# EAGLE design ME433_board (EAGLE 8.7.1)
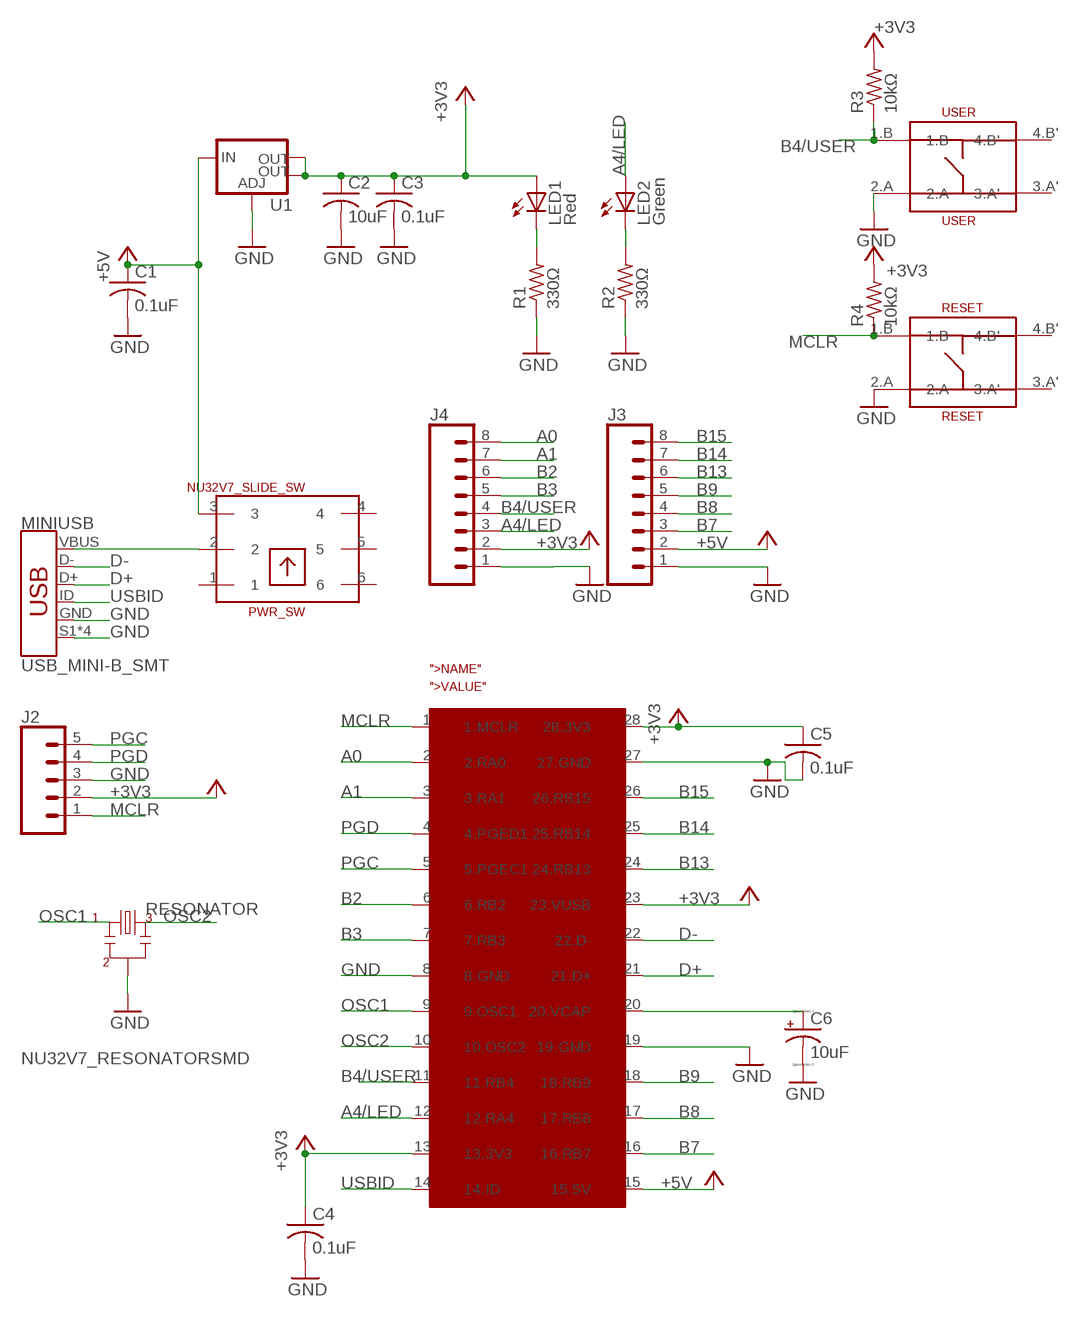
[diagram p0: schematic, sheet 1]

## Parts
C1  0.1uF  C-USC0603  [C0603]
C2  10uF  C-USC0603  [C0603]
C3  0.1uF  C-USC0603  [C0603]
C4  0.1uF  C-USC0603  [C0603]
C5  0.1uF  C-USC0603  [C0603]
C6  10uF  CPOL-US153CLV-0605  [153CLV-0605]
J2  CONN_05  [1X05]
J3  CONN_08"  [1X08]
J4  CONN_08"  [1X08]
LED1  Red  LEDSML0603  [SML0603]
LED2  Green  LEDSML0603  [SML0603]
MINIUSB  USB_MINI-B_SMT  [USB-MINIB]
PWR_SW  NU32V7_SLIDE_SW  [NU32V7_SLIDE_SW]
R1  330Ω  R-US_R0603  [R0603]
R2  330Ω  R-US_R0603  [R0603]
R3  10kΩ  R-US_R0603  [R0603]
R4  10kΩ  R-US_R0603  [R0603]
RESET  RESET  NU32V7_MOM_SW  [NU32V7_MOM_SW]
RESONATOR  NU32V7_RESONATORSMD  [NU32V7_RESONATOR-SMD]
U1  NU32V7_V_REG_LM1117SOT223  [NU32V7_SOT223]
U$1  PIC32  [DIL28-3]
USER  USER  NU32V7_MOM_SW  [NU32V7_MOM_SW]

## Nets
+3V3: C2.1 C3.1 C4.1 C5.1 J2.2 J4.2 LED1.A R3.2 R4.2 U1.2(OUT) U1.4(OUT) U$1.13(13.3V3) U$1.23(23.VUSB) U$1.28(28.3V3)
+5V: C1.1 J3.2 PWR_SW.3 U1.3(IN) U$1.15(15.5V)
A0: J4.8 U$1.2(2.RA0)
A1: J4.7 U$1.3(3.RA1)
A4/LED: J4.3 LED2.A U$1.12(12.RA4)
B2: J4.6 U$1.6(6.RB2)
B3: J4.5 U$1.7(7.RB3)
B4/USER: J4.4 R3.1 U$1.11(11.RB4) USER.1.B
B7: J3.3 U$1.16(16.RB7)
B8: J3.4 U$1.17(17.RB8)
B9: J3.5 U$1.18(18.RB9)
B13: J3.6 U$1.24(24.RB13)
B14: J3.7 U$1.25(25.RB14)
B15: J3.8 U$1.26(26.RB15)
D+: MINIUSB.D+ U$1.21(21.D+)
D-: MINIUSB.D- U$1.22(22.D-)
GND: C1.2 C2.2 C3.2 C4.2 C5.2 C6.- J2.3 J3.1 J4.1 MINIUSB.GND MINIUSB.S1(SHIELD) MINIUSB.S2(SHIELD) MINIUSB.S3(SHIELD) MINIUSB.S4(SHIELD) R1.1 R2.1 RESET.2.A RESONATOR.2 U1.1(ADJ) U$1.8(8.GND) U$1.19(19.GND) U$1.27(27.GND) USER.2.A
MCLR: J2.1 R4.1 RESET.1.B U$1.1(1.MCLR)
N$1: MINIUSB.VBUS PWR_SW.2
N$2: LED2.C R2.2
N$3: LED1.C R1.2
N$21: C6.+ U$1.20(20.VCAP)
OSC1: RESONATOR.1 U$1.9(9.OSC1)
OSC2: RESONATOR.3 U$1.10(10.OSC2)
PGC: J2.5 U$1.5(5.PGEC1)
PGD: J2.4 U$1.4(4.PGED1)
USBID: MINIUSB.ID U$1.14(14.ID)
Unconnected: PWR_SW.1 PWR_SW.4 PWR_SW.5 PWR_SW.6 RESET.3.A' RESET.4.B' USER.3.A' USER.4.B'

## Library data of the parts
C1-C5 = ME433_library:C-US: CAPACITOR, American symbol
C6 = ME433_library:CPOL-US: POLARIZED CAPACITOR, American symbol
J2 = SparkFun-Connectors:CONN_05: Multi connection point. Often used as Generic Header-pin footprint for 0.1 inch spaced/style header connections On any of the 0.1 inch spaced packages, you can populate with these: Break Away Headers - Straight <https://www.sparkfun.com/products/116> (PRT-00116) Break Away Male Headers - Right Angle <https://www.sparkfun.com/products/553> (PRT-00553) Female Headers <https://www.sparkfun.com/products/115> (PRT-00115) Break Away Headers - Machine Pin <https://www.sparkfun.com/products/117> (PRT-00117) Break Away Female Headers - Swiss Machine Pin <https://www.sparkfun.com/products/743> (PRT-00743) For SCREWTERMINALS and SPRING TERMINALS visit here: Screw Terimnals on SparkFun.com <https://www.sparkfun.com/search/results?term=Screw+Terminals> (5mm/3.5mm/2.54mm spacing) This device is also useful as a general connection point to wire up your design to another part of your project. Our various solder wires solder well into these plated through hole pads. Hook-Up Wire - Assortment (Stranded, 22 AWG) <https://www.sparkfun.com/products/11375> (PRT-11375) Hook-Up Wire - Assortment (Solid Core, 22 AWG) <https://www.sparkfun.com/products/11367> (PRT-11367) View the entire wire category on our website here <https://www.sparkfun.com/categories/141> Special notes: Molex polarized connector foot print use with SKU : PRT-08231 with associated crimp pins and housings. 1MM SMD Version SKU: PRT-10208
J3 J4 = SparkFun-Connectors:CONN_08: Multi connection point. Often used as Generic Header-pin footprint for 0.1 inch spaced/style header connections On any of the 0.1 inch spaced packages, you can populate with these: Break Away Headers - Straight <https://www.sparkfun.com/products/116> (PRT-00116) Break Away Male Headers - Right Angle <https://www.sparkfun.com/products/553> (PRT-00553) Female Headers <https://www.sparkfun.com/products/115> (PRT-00115) Break Away Headers - Machine Pin <https://www.sparkfun.com/products/117> (PRT-00117) Break Away Female Headers - Swiss Machine Pin <https://www.sparkfun.com/products/743> (PRT-00743) Arduino Stackable Header - 8 Pin <https://www.sparkfun.com/products/9279> (PRT-09279) For SCREWTERMINALS and SPRING TERMINALS visit here: Screw Terimnals on SparkFun.com <https://www.sparkfun.com/search/results?term=Screw+Terminals> (5mm/3.5mm/2.54mm spacing) This device is also useful as a general connection point to wire up your design to another part of your project. Our various solder wires solder well into these plated through hole pads. Hook-Up Wire - Assortment (Stranded, 22 AWG) <https://www.sparkfun.com/products/11375> (PRT-11375) Hook-Up Wire - Assortment (Solid Core, 22 AWG) <https://www.sparkfun.com/products/11367> (PRT-11367) View the entire wire category on our website here <https://www.sparkfun.com/categories/141> Special notes: Molex polarized connector foot print use with SKU : PRT-08231 with associated crimp pins and housings. 1MM SMD Version SKU: PRT-10208 NOTES ON THE VARIANTS LOCK and LOCK_LONGPADS... This footprint was designed to help hold the alignment of a through-hole component (i.e. 6-pin header) while soldering it into place. You may notice that each hole has been shifted either up or down by 0.005 of an inch from it's more standard position (which is a perfectly straight line). This slight alteration caused the pins (the squares in the middle) to touch the edges of the holes. Because they are alternating, it causes a "brace" to hold the component in place. 0.005 has proven to be the perfect amount of "off-center" position when using our standard breakaway headers. Although looks a little odd when you look at the bare footprint, once you have a header in there, the alteration is very hard to notice. Also,if you push a header all the way into place, it is covered up entirely on the bottom side.; PROD_ID: CONN-08438
LED1 LED2 = ME433_library:LED: LED OSRAM: - CHIPLED LG R971, LG N971, LY N971, LG Q971, LY Q971, LO R971, LY R971 LH N974, LH R974 LS Q976, LO Q976, LY Q976 LO Q996 - Hyper CHIPLED LW Q18S LB Q993, LB Q99A, LB R99A - SideLED LS A670, LO A670, LY A670, LG A670, LP A670 LB A673, LV A673, LT A673, LW A673 LH A674 LY A675 LS A676, LA A676, LO A676, LY A676, LW A676 LS A679, LY A679, LG A679 - Hyper Micro SIDELED® LS Y876, LA Y876, LO Y876, LY Y876 LT Y87S - SmartLED LW L88C, LW L88S LB L89C, LB L89S, LG L890 LS L89K, LO L89K, LY L89K LS L896, LA L896, LO L896, LY L896 - TOPLED LS T670, LO T670, LY T670, LG T670, LP T670 LSG T670, LSP T670, LSY T670, LOP T670, LYG T670 LG T671, LOG T671, LSG T671 LB T673, LV T673, LT T673, LW T673 LH T674 LS T676, LA T676, LO T676, LY T676, LB T676, LH T676, LSB T676, LW T676 LB T67C, LV T67C, LT T67C, LS T67K, LO T67K, LY T67K, LW E67C LS E67B, LA E67B, LO E67B, LY E67B, LB E67C, LV E67C, LT E67C LW T67C LS T679, LY T679, LG T679 LS T770, LO T770, LY T770, LG T770, LP T770 LB T773, LV T773, LT T773, LW T773 LH T774 LS E675, LA E675, LY E675, LS T675 LS T776, LA T776, LO T776, LY T776, LB T776 LHGB T686 LT T68C, LB T68C - Hyper Mini TOPLED® LB M676 - Mini TOPLED Santana® LG M470 LS M47K, LO M47K, LY M47K Source: http://www.osram.convergy.de LUXEON: - LUMILED® LXK2-PW12-R00, LXK2-PW12-S00, LXK2-PW14-U00, LXK2-PW14-V00 LXK2-PM12-R00, LXK2-PM12-S00, LXK2-PM14-U00 LXK2-PE12-Q00, LXK2-PE12-R00, LXK2-PE12-S00, LXK2-PE14-T00, LXK2-PE14-U00 LXK2-PB12-K00, LXK2-PB12-L00, LXK2-PB12-M00, LXK2-PB14-N00, LXK2-PB14-P00, LXK2-PB14-Q00 LXK2-PR12-L00, LXK2-PR12-M00, LXK2-PR14-Q00, LXK2-PR14-R00 LXK2-PD12-Q00, LXK2-PD12-R00, LXK2-PD12-S00 LXK2-PH12-R00, LXK2-PH12-S00 LXK2-PL12-P00, LXK2-PL12-Q00, LXK2-PL12-R00 Source: www.luxeon.com KINGBRIGHT: KA-3528ASYC Source: www.kingbright.com
MINIUSB = ME433_library:USB_MINI-B: USB type Mini-B Connector Breaks out 5th pin, and includes shield pins if needed. SparkFun Products: SparkFun FTDI Basic Breakout <https://www.sparkfun.com/products/9716> SparkFun XBee Explorer USB <https://www.sparkfun.com/products/11812> SparkFun Redboard <https://www.sparkfun.com/products/12757>; PROD_ID: CONN-08193; SF_ID: PRT-00587
PWR_SW = ME433_library:NU32V7_SLIDE_SW
R1-R4 = ME433_library:R-US_: RESISTOR, American symbol
RESET USER = ME433_library:NU32V7_MOM_SW
RESONATOR = ME433_library:NU32V7_RESONATOR: Resonator Small SMD resonator. This is the itty bitty 10/20MHz resonators with built in caps. CSTCE10M0G55 and CSTCE20M0V53. Footprint has been reviewed closely but hasn't been tested yet.
U1 = ME433_library:NU32V7_V_REG_LM1117: Voltage Regulator LM1117 Standard adjustable voltage regulator but in SMD form. Spark Fun Electronics SKU : COM-00595; PROD_ID: VREG-08170
U$1 = ME433_library:PIC32

## Board
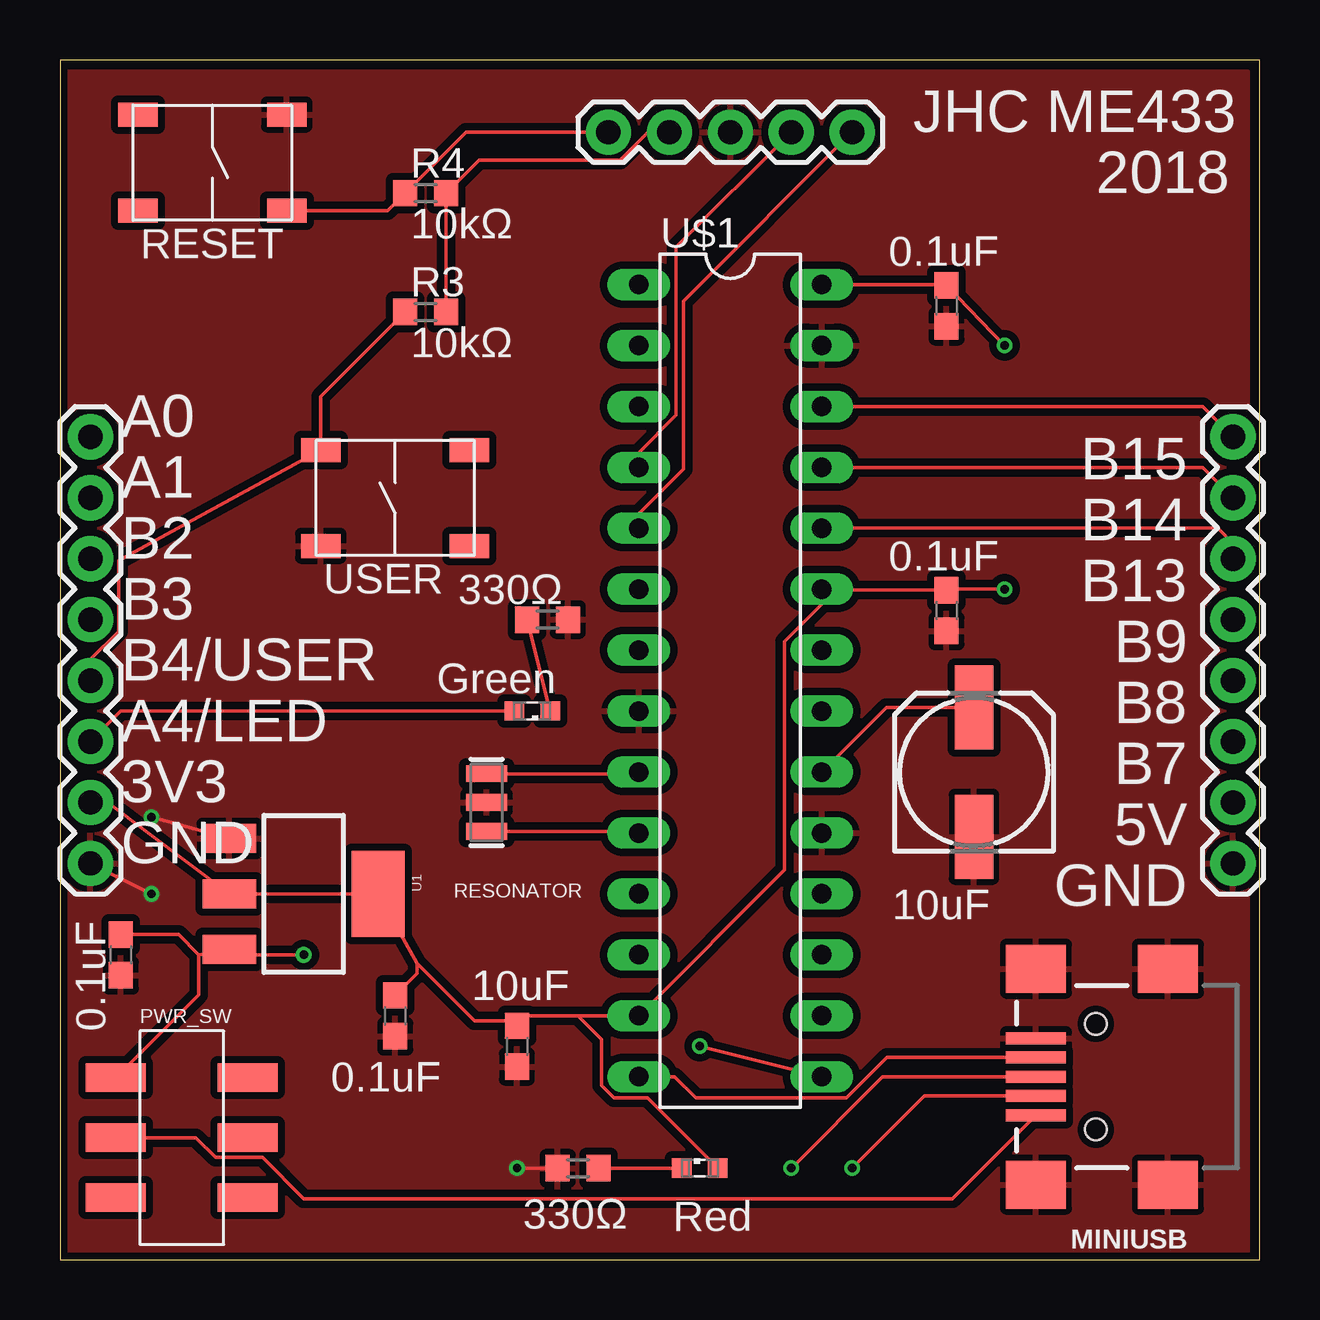
[diagram p1: board, top side]
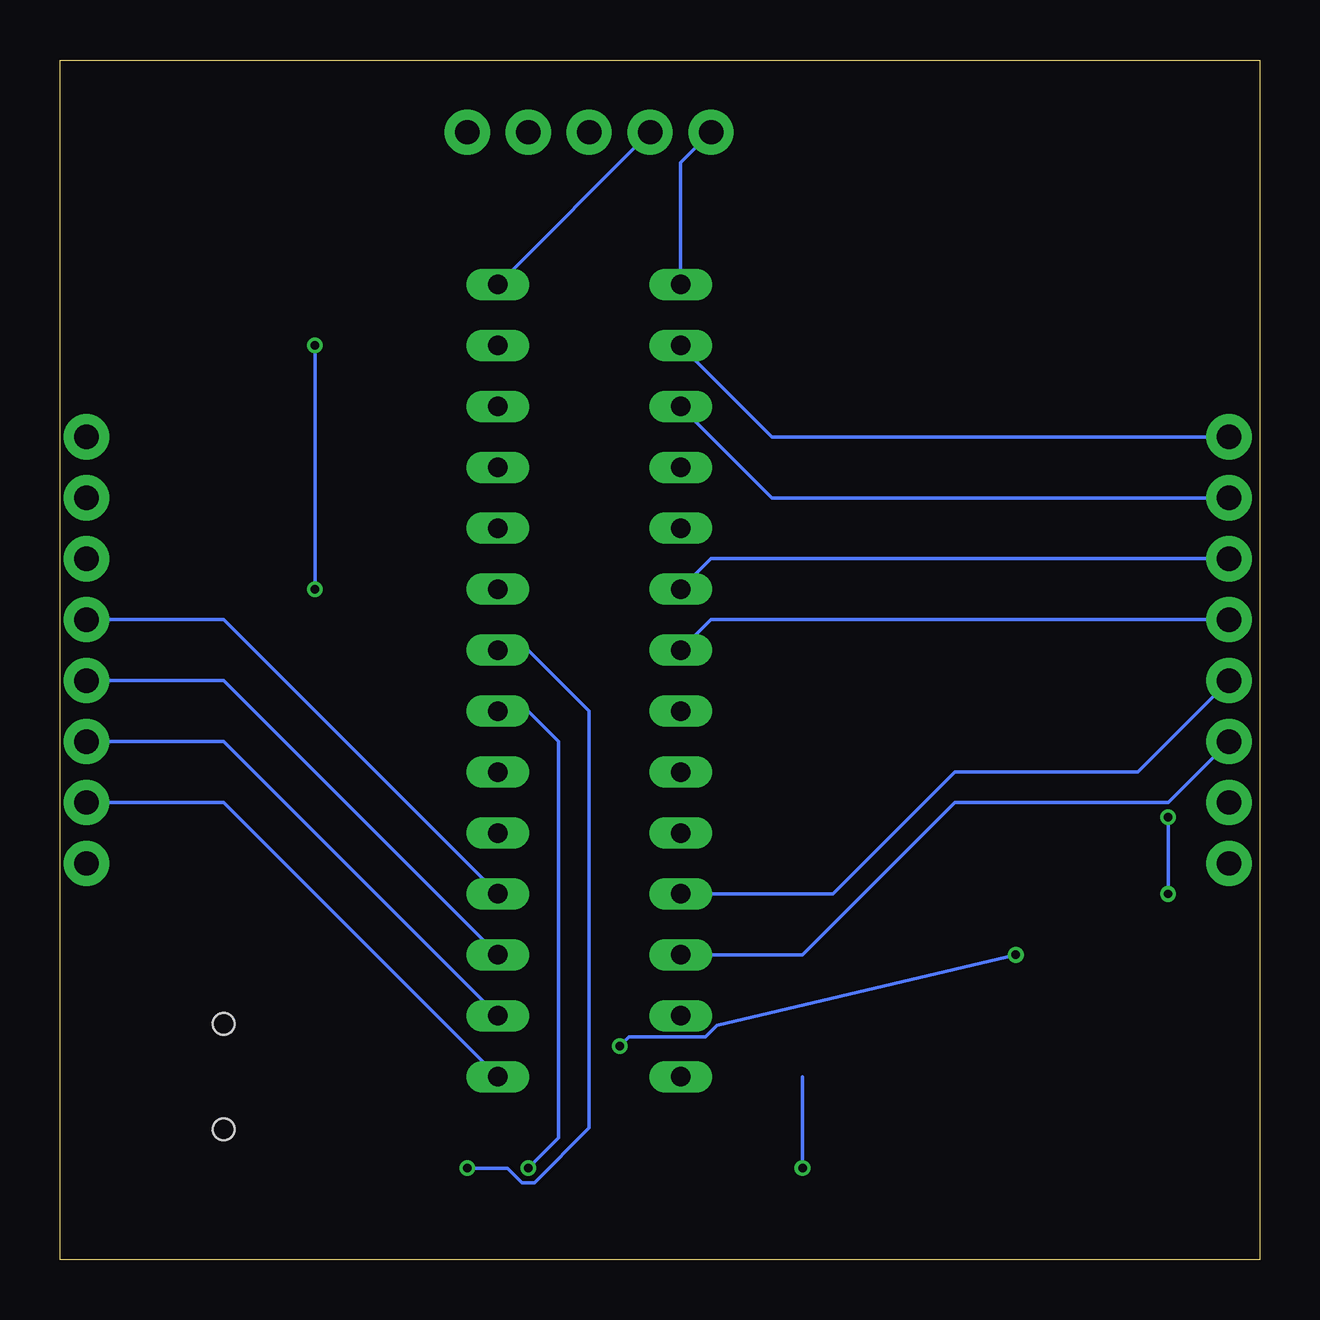
[diagram p2: board, bottom side, seen from below]

Size 50 x 50 mm. Coordinates in mm from the lower left corner, seen from the top.
Outline: 0,0 50,0 50,50 0,50 0,0
Copper layers (1*16): Top 0.035mm / dielectric 1.5mm / Bottom 0.035mm
Design rules "SeeedStudio_2layer_DRU_no_angle_20140221": minimum track width 6mil, minimum drill 12mil, track to track 6mil, track to pad 6mil, pad to pad 6mil, via to via 6mil, smd to smd 0mil, copper to edge 10mil, drill to drill 10mil, minimum pad ring 10mil, minimum via ring 6mil, stop-mask expansion 2mil, vias tented up to drill 100mil, thermal gap 10mil

### Footprints (pad centres in the part's own frame; a part is rotated, then mirrored left to right if it is on the bottom)
C0603 = smd 1.1 x 1: 1 -0.85,0; 2 0.85,0
153CLV-0605 = smd 3.5 x 1.6: + 2.7,0; - -2.7,0
1X05 = drill 1.016 pad 1.88: 1 0,0; 2 2.54,0; 3 5.08,0; 4 7.62,0; 5 10.16,0
1X08 = drill 1.016 pad 1.88: 1 0,0; 2 2.54,0; 3 5.08,0; 4 7.62,0; 5 10.16,0; 6 12.7,0; 7 15.24,0; 8 17.78,0
SML0603 = smd 0.8 x 0.8: A 0.75,0; C -0.75,0
USB-MINIB = smd 2.5 x 0.5: D+ 2.5,0; D- 2.5,0.8; GND 2.5,-1.6; ID 2.5,-0.8; VBUS 2.5,1.6 | smd 2.5 x 2: S1 -3,4.5; S2 2.5,4.5; S3 -3,-4.5; S4 2.5,-4.5 | hole 0.9: 0,2.2; 0,-2.2
NU32V7_SLIDE_SW = smd 1.2 x 2.5: 1 -2.5,2.75; 2 0,2.75; 3 2.5,2.75; 4 2.5,-2.75; 5 0,-2.75; 6 -2.5,-2.75
R0603 = smd 1 x 1.1: 1 -0.85,0; 2 0.85,0
NU32V7_MOM_SW = smd 1.65 x 1: 1.B -3.1,2; 2.A -3.1,-2; 3.A' 3.1,-2; 4.B' 3.1,2
NU32V7_RESONATOR-SMD = smd 0.7 x 1.7: 1 -1.2,0; 2 0,0; 3 1.2,0
NU32V7_SOT223 = smd 1.219 x 2.235: 1 -2.311,-3.099; 2 0,-3.099; 3 2.311,-3.099 | smd 3.6 x 2.2: 4 0,3.099
DIL28-3 = drill 0.813 long: 1 -16.51,-3.81; 2 -13.97,-3.81; 3 -11.43,-3.81; 4 -8.89,-3.81; 5 -6.35,-3.81; 6 -3.81,-3.81; 7 -1.27,-3.81; 8 1.27,-3.81; 9 3.81,-3.81; 10 6.35,-3.81; 11 8.89,-3.81; 12 11.43,-3.81; 13 13.97,-3.81; 14 16.51,-3.81; 15 16.51,3.81; 16 13.97,3.81; 17 11.43,3.81; 18 8.89,3.81; 19 6.35,3.81; 20 3.81,3.81; 21 1.27,3.81; 22 -1.27,3.81; 23 -3.81,3.81; 24 -6.35,3.81; 25 -8.89,3.81; 26 -11.43,3.81; 27 -13.97,3.81; 28 -16.51,3.81

### Placement (x,y rotation side)
C1  2.54,12.7 270 top
C2  19.05,8.89 270 top
C3  13.97,10.16 270 top
C4  36.96,27.05 270 top
C5  36.96,39.75 270 top
C6  38.1,20.32 90 top
J2  22.86,46.99 0 top
J3  48.9,16.51 90 top
J4  1.27,16.51 90 top
LED1  26.67,3.81 0 top
LED2  19.68,22.86 180 top
MINIUSB  43.18,7.62 180 top
PWR_SW  5.08,5.08 90 top
R1  21.59,3.81 0 top
R2  20.32,26.67 180 top
R3  15.24,39.5 0 top
R4  15.24,44.45 0 top
RESET  6.35,45.72 180 top
RESONATOR  17.78,19.05 270 top
U1  10.16,15.24 270 top
U$1  27.94,24.13 270 top
USER  13.97,31.75 0 top

### Tracks (layer width: path | path; a pad name or v marks a point on that pad's centre or on a via)
+3V3  (via drill 0.35)
  Top 0.152: 21.59,10.16 U$1.13 30.2,16.23 30.2,25.77 31.75,27.32 U$1.23 31.79,27.9 C4.1 37,27.94 v39.37,27.94 | 21.59,10.16 19.47,10.16 19.26,9.95 | 19.26,9.95 C2.1 | 14.88,12.35 U1.4 U1.2 1.98,19.05 J4.2 | 14.88,12.35 17.28,9.95 19.26,9.95 | U$1.28 36.92,40.64 | 36.92,40.64 C5.1 | C3.1 14.88,11.93 14.88,12.35 | LED1.A 24.5,6.73 23.1,6.73 22.58,7.25 22.58,9.17 21.59,10.16 | v39.37,38.1 36.92,40.64 | R3.2 R4.2 17.46,45.82 23.34,45.82 24.51,46.99 J2.2
  Bottom 0.152: J2.2 U$1.28 | v39.37,27.94 v39.37,38.1
+5V  (via drill 0.35)
  Top 0.152: PWR_SW.3 5.79,11.04 5.79,12.7 | 5.79,12.7 U1.3 6.02,12.7 v10.16,12.7 | C1.1 4.94,13.55 5.79,12.7 | v26.67,8.89 U$1.15
  Bottom 0.152: U$1.15 43.18,19.05 J3.2 | v10.16,12.7 22.61,9.76 23.1,9.27 26.29,9.27 v26.67,8.89
A0
  Bottom 0.152: J4.8 20.32,34.29 U$1.2
A1
  Bottom 0.152: J4.7 20.32,31.75 U$1.3
A4/LED
  Top 0.152: J4.3 2.54,22.86 LED2.A
  Bottom 0.152: J4.3 3.81,19.05 12.7,19.05 19.05,12.7 U$1.12
B2
  Bottom 0.152: J4.6 22.86,29.21 U$1.6
B3
  Bottom 0.152: J4.5 22.86,26.67 U$1.7
B4/USER
  Top 0.152: J4.4 1.27,25.02 2.44,26.19 2.44,29.13 USER.1.B 10.87,35.98 R3.1
  Bottom 0.152: J4.4 5.08,20.32 12.7,20.32 17.78,15.24 U$1.11
B7
  Bottom 0.152: U$1.16 43.18,21.59 J3.3
B8
  Bottom 0.152: U$1.17 43.18,24.13 J3.4
B9
  Bottom 0.152: U$1.18 43.18,26.67 J3.5
B13
  Top 0.152: U$1.24 48.26,30.48 48.91,29.83 J3.6
B14
  Top 0.152: U$1.25 47.62,33.02 J3.7
B15
  Top 0.152: U$1.26 47.62,35.56 J3.8
D+  (via drill 0.35)
  Top 0.152: MINIUSB.D+ 34.29,7.62 v30.48,3.81
  Bottom 0.152: v30.48,3.81 29.21,5.08 29.21,21.59 30.48,22.86 U$1.21
D-  (via drill 0.35)
  Top 0.152: MINIUSB.D- 36.03,6.82 v33.02,3.81
  Bottom 0.152: v33.02,3.81 31.34,3.81 30.73,3.2 30.23,3.2 27.94,5.49 27.94,22.86 30.48,25.4 U$1.22
GND  (via drill 0.35)
  Top 0.152: R1.1 v19.05,3.81 | J4.1 v3.81,15.24 | v3.81,18.44 U1.1
  Bottom 0.152: v19.05,3.81 19.05,7.62 | v3.81,15.24 v3.81,18.44
  pour Top (isolate 0.305): 0,49.53 0,0 49.53,0 49.53,49.53
MCLR
  Top 0.152: RESET.1.B 13.66,43.72 R4.1 16.93,46.99 J2.1
  Bottom 0.152: J2.1 24.13,45.72 U$1.1
N$1
  Top 0.152: PWR_SW.2 5.66,5.08 6.49,4.25 8.45,4.25 10.16,2.54 37.2,2.54 MINIUSB.VBUS
N$2
  Top 0.152: LED2.C R2.2
N$3
  Top 0.152: R1.2 LED1.C
N$21
  Top 0.152: U$1.20 34.45,23.02 C6.+
OSC1
  Top 0.152: U$1.9 24.06,20.25 RESONATOR.1
OSC2
  Top 0.152: U$1.10 24.06,17.85 RESONATOR.3
PGC
  Top 0.152: J2.5 25.98,39.95 25.98,32.96 24.13,31.1 U$1.5
PGD
  Top 0.152: J2.4 25.68,42.19 25.68,35.19 24.13,33.64 U$1.4
USBID
  Top 0.152: MINIUSB.ID 34.47,8.42 32.78,6.73 26.51,6.73 25.62,7.62 U$1.14

### Text on the board
tPlace: JHC ME433 | 2018 | A0 | B15 | A1 | B14 | B2 | B13 | B3 | B9 | B4/USER | B8 | A4/LED | B7 | 3V3 | 5V | GND | GND
200bmp: C:/Users/joshc/Desktop/logo_bmp.bmp